# Altium schematic sheet 02.Pads and Knobs.SchDoc
size A4
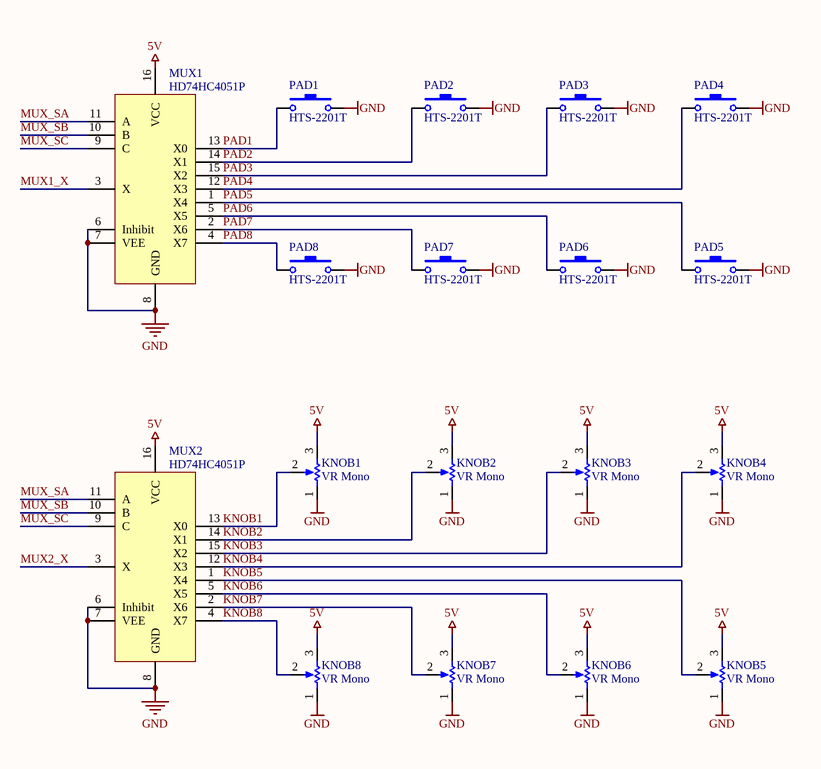
[diagram p0: 02.Pads and Knobs.SchDoc]

## Parts
KNOB1  VR Mono  [RK11K113]
KNOB2  VR Mono  [RK11K113]
KNOB3  VR Mono  [RK11K113]
KNOB4  VR Mono  [RK11K113]
KNOB5  VR Mono  [RK11K113]
KNOB6  VR Mono  [RK11K113]
KNOB7  VR Mono  [RK11K113]
KNOB8  VR Mono  [RK11K113]
MUX1  HD74HC4051P  [DIP-16]
MUX2  HD74HC4051P  [DIP-16]
PAD1  HTS-2201T  [ALPS-SKHC-12mm]
PAD2  HTS-2201T  [ALPS-SKHC-12mm]
PAD3  HTS-2201T  [ALPS-SKHC-12mm]
PAD4  HTS-2201T  [ALPS-SKHC-12mm]
PAD5  HTS-2201T  [ALPS-SKHC-12mm]
PAD6  HTS-2201T  [ALPS-SKHC-12mm]
PAD7  HTS-2201T  [ALPS-SKHC-12mm]
PAD8  HTS-2201T  [ALPS-SKHC-12mm]

## Nets
5V: KNOB1.3 KNOB2.3 KNOB3.3 KNOB4.3 KNOB5.3 KNOB6.3 KNOB7.3 KNOB8.3 MUX1.16(VCC) MUX2.16(VCC)
GND: KNOB1.1 KNOB2.1 KNOB3.1 KNOB4.1 KNOB5.1 KNOB6.1 KNOB7.1 KNOB8.1 MUX1.6(Inhibit) MUX1.7(VEE) MUX1.8(GND) MUX2.6(Inhibit) MUX2.7(VEE) MUX2.8(GND) PAD1.1 PAD2.1 PAD3.1 PAD4.1 PAD5.1 PAD6.1 PAD7.1 PAD8.1
KNOB1: KNOB1.2 MUX2.13(X0)
KNOB2: KNOB2.2 MUX2.14(X1)
KNOB3: KNOB3.2 MUX2.15(X2)
KNOB4: KNOB4.2 MUX2.12(X3)
KNOB5: KNOB5.2 MUX2.1(X4)
KNOB6: KNOB6.2 MUX2.5(X5)
KNOB7: KNOB7.2 MUX2.2(X6)
KNOB8: KNOB8.2 MUX2.4(X7)
MUX1_X: MUX1.3(X)
MUX2_X: MUX2.3(X)
MUX_SA: MUX1.11(A) MUX2.11(A)
MUX_SB: MUX1.10(B) MUX2.10(B)
MUX_SC: MUX1.9(C) MUX2.9(C)
PAD1: MUX1.13(X0) PAD1.2
PAD2: MUX1.14(X1) PAD2.2
PAD3: MUX1.15(X2) PAD3.2
PAD4: MUX1.12(X3) PAD4.2
PAD5: MUX1.1(X4) PAD5.2
PAD6: MUX1.5(X5) PAD6.2
PAD7: MUX1.2(X6) PAD7.2
PAD8: MUX1.4(X7) PAD8.2

## Library data of the parts
MUX1 MUX2 = TC74HC4051AF
PAD1-PAD8 = Tact Switch HTS-2201T